# Altium project 16515-SBC_TO_MC2_PCA.PrjPcb (part 2 of 2)
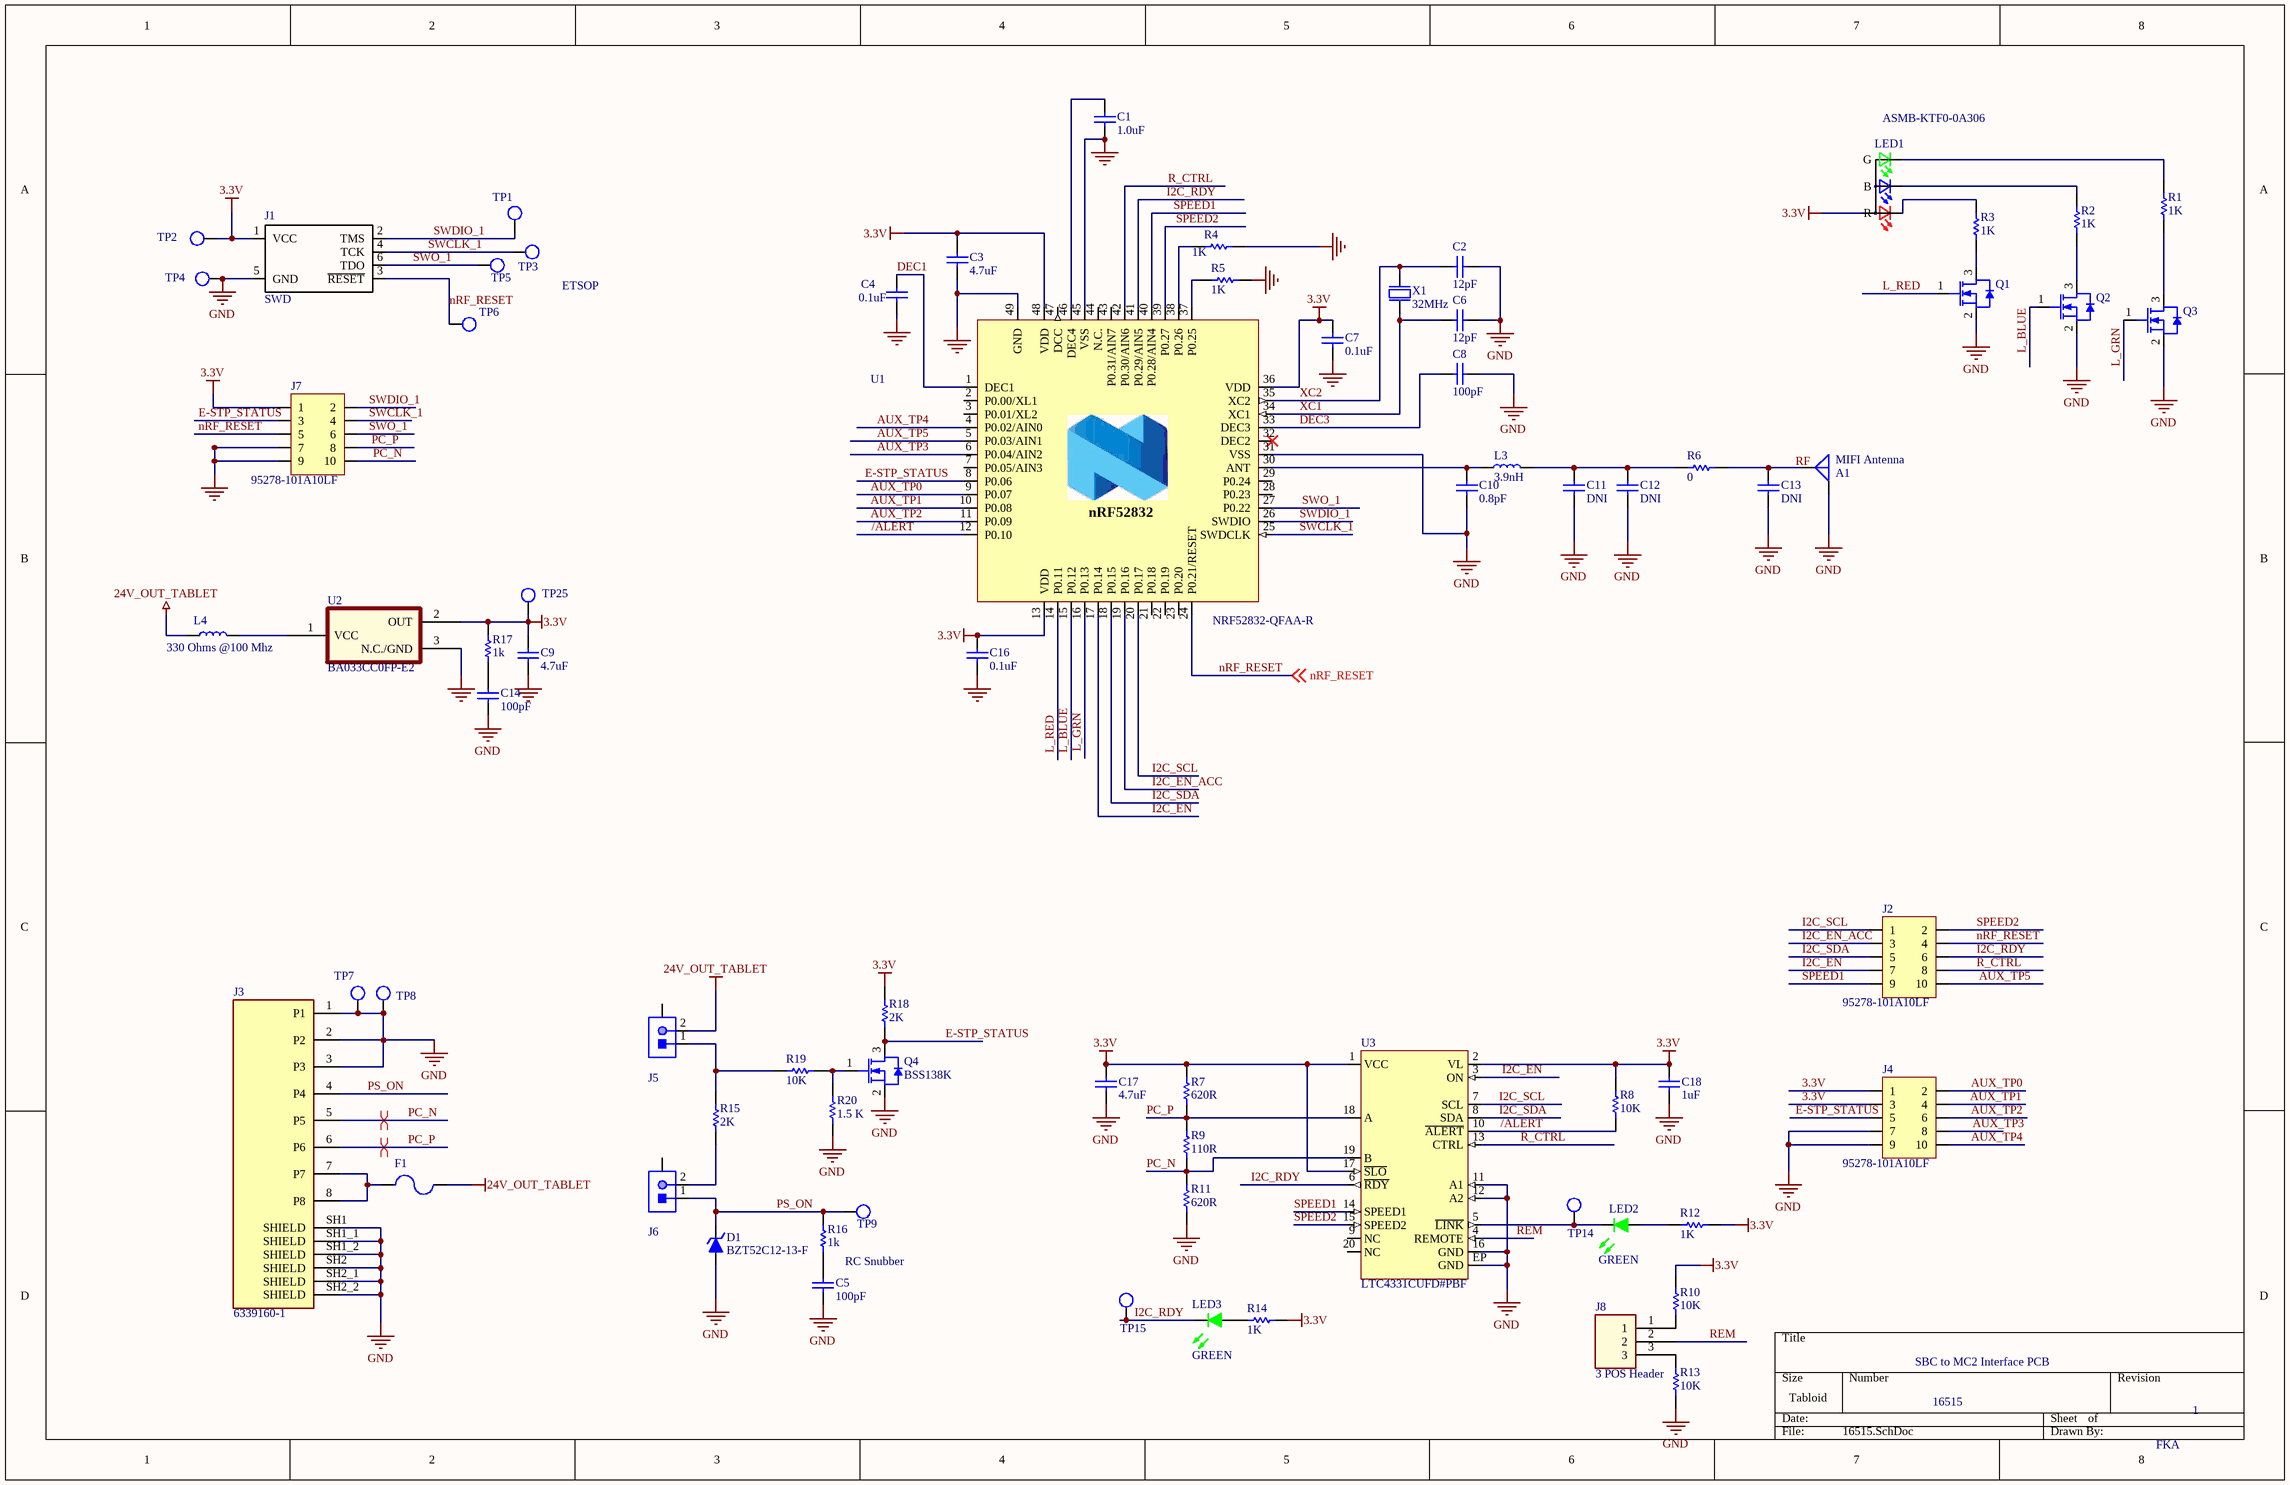
[diagram p1: 16515.SchDoc]

## Sheet 16515.SchDoc: SBC to MC2 Interface PCB (continued)

### Library data of the parts
A1 = ANT: Antenna
C1 = Cap NP: 1µF ±10% 6.3V Ceramic Capacitor X5R 0603 (1608 Metric); Manufacturer 1: Samsung; Manufacturer Part Number 1: CL10A105KQ8NNNC; Capacitance: 1uF; Value: 1.0uF; Supplier 1: Digi-Key; Supplier Part Number 1: 1276-1036-2-ND; Stock 1: 964000; Pricing 1: 4000=0.00607, 8000=0.00554, 12000=0.00528, 28000=0.00502, 100000=0.00363 (USD); RoHS: Yes; Mount: Surface Mount; Case/Package: 0603; Case Code (Metric): 1608; Case Code (Imperial): 0603; Min Operating Temperature: -55°C; Max Operating Temperature: 85°C; Packaging: Tape and Reel; Tolerance: 10%; Package Quantity: 1; Voltage Rating: 6.3V; Dielectric: X5R; Voltage Rating (DC): 6.3V; Length: 1.6mm; Height: 0.8mm; Width: 0.031inch; Thickness: 0.035inch; Depth: 0.8mm; Radiation Hardening: No; Lead Free: Lead Free; ComponentLink1URL: https://datasheet.ciiva.com/26838/getdatasheetpartid-355285-26838337.pdf?src-supplier=Verical; ComponentLink1Description: https://datasheet.ciiva.com/26838/getdatasheetpartid-355285-26838337.pdf?src-supplier=Verical; ComponentLink2URL: https://datasheet.ciiva.com/25801/cl10a105kq8nnnc-25801975.pdf?src-supplier=Digi-Key; ComponentLink2Description: https://datasheet.ciiva.com/25801/cl10a105kq8nnnc-25801975.pdf?src-supplier=Digi-Key; ComponentLink3URL: https://datasheet.ciiva.com/16199/cl10a105ko8nnnc-16199274.pdf?src-supplier=Future+Electronics; ComponentLink3Description: https://datasheet.ciiva.com/16199/cl10a105ko8nnnc-16199274.pdf?src-supplier=Future+Electronics
C2 C6 = Cap NP: 12pF ±5% 25V Ceramic Capacitor C0G, NP0 0402 (1005 Metric); Manufacturer 1: Murata; Manufacturer Part Number 1: GRM1555C1E120JA01D; Value: 12pF; Supplier 1: Digi-Key; Supplier Part Number 1: 490-8170-2-ND; Stock 1: 110000; Pricing 1: 10000=0.00588, 20000=0.00560, 30000=0.00532, 50000=0.00476, 100000=0.00420 (USD); RoHS: Yes; Mount: Surface Mount; Case/Package: 0402; Case Code (Metric): 1005; Case Code (Imperial): 0402; Min Operating Temperature: -55°C; Max Operating Temperature: 125°C; Capacitance: 12pF; Tolerance: 5%; Packaging: Tape and Reel; Package Quantity: 10000; Voltage Rating: 25V; Voltage Rating (DC): 25V; Dielectric: C0G; Termination: SMD/SMT; Length: 1mm; Height: 0.5mm; Width: 0.02inch; Thickness: 0.022inch; Depth: 0.5mm; Radiation Hardening: No; Lead Free: Lead Free; ComponentLink1URL: https://datasheet.ciiva.com/29542/grm1555c1e120ja01-01-29542163.pdf?src-supplier=Digi-Key; ComponentLink1Description: https://datasheet.ciiva.com/29542/grm1555c1e120ja01-01-29542163.pdf?src-supplier=Digi-Key; ComponentLink2URL: https://datasheet.ciiva.com/29542/partnumbering-e-01-29542165.pdf?src-supplier=Digi-Key; ComponentLink2Description: https://datasheet.ciiva.com/29542/partnumbering-e-01-29542165.pdf?src-supplier=Digi-Key; ComponentLink3URL: https://datasheet.ciiva.com/16467/product-16467323.pdf?src-supplier=Future+Electronics; ComponentLink3Description: https://datasheet.ciiva.com/16467/product-16467323.pdf?src-supplier=Future+Electronics
C3 C9 = Cap NP: 4.7µF ±10% 35V Ceramic Capacitor X5R 0603 (1608 Metric); Manufacturer 1: Murata; Manufacturer Part Number 1: GRM188R6YA475KE15D; Value: 4.7uF; Supplier 1: Digi-Key; Supplier Part Number 1: 490-7205-2-ND; Stock 1: 284000; Pricing 1: 4000=0.09384, 8000=0.08832, 12000=0.08556, 28000=0.08280, 100000=0.07728 (USD); RoHS: Yes; Mount: Surface Mount; Case/Package: 0603; Weight: 0.000222oz; Case Code (Metric): 1608; Case Code (Imperial): 0603; Material: Ceramic; Min Operating Temperature: -55°C; Max Operating Temperature: 85°C; Capacitance: 4.7uF; Tolerance: 10%; Voltage Rating: 35V; Packaging: Tape and Reel; Package Quantity: 4000; Dielectric: X5R; Voltage: 35V; Termination: SMD/SMT; Composition: Ceramic; Voltage Rating (DC): 35V; Length: 1.6mm; Height: 0.8mm; Width: 0.8mm; Thickness: 0.031inch; Depth: 0.8mm; REACH SVHC: No SVHC; Lead Free: Lead Free; ComponentLink1URL: https://datasheet.ciiva.com/46444/1769893-46444984.pdf?src-supplier=Element14; ComponentLink1Description: https://datasheet.ciiva.com/46444/1769893-46444984.pdf?src-supplier=Element14; ComponentLink2URL: https://datasheet.ciiva.com/46444/1769893-46444985.pdf?src-supplier=Element14; ComponentLink2Description: https://datasheet.ciiva.com/46444/1769893-46444985.pdf?src-supplier=Element14; ComponentLink3URL: https://datasheet.ciiva.com/14906/partnumbering-e-01-14906426.pdf?src-supplier=Digi-Key; ComponentLink3Description: https://datasheet.ciiva.com/14906/partnumbering-e-01-14906426.pdf?src-supplier=Digi-Key; ComponentLink4URL: https://datasheet.ciiva.com/14906/partnumbering-e-01-14906427.pdf?src-supplier=Digi-Key; ComponentLink4Description: https://datasheet.ciiva.com/14906/partnumbering-e-01-14906427.pdf?src-supplier=Digi-Key; ComponentLink5URL: https://datasheet.ciiva.com/14906/partnumbering-e-01-14906428.pdf?src-supplier=Digi-Key; ComponentLink5Description: https://datasheet.ciiva.com/14906/partnumbering-e-01-14906428.pdf?src-supplier=Digi-Key
C4 C7 C16 = Cap NP: 0.1µF ±10% 50V Ceramic Capacitor X5R 0402 (1005 Metric); Manufacturer 1: Yageo; Manufacturer Part Number 1: CC0402KRX5R9BB104; Capacitance: 100nF; Value: 0.1uF; Supplier 1: Digi-Key; Supplier Part Number 1: 311-3342-2-ND; Stock 1: 827411; Pricing 1: 10000=0.00666, 20000=0.00634, 30000=0.00602, 50000=0.00539, 100000=0.00476 (USD); RoHS: Yes; Mount: Surface Mount; Case/Package: 0402; Min Operating Temperature: -55°C; Max Operating Temperature: 85°C; Packaging: Tape and Reel; Voltage Rating: 50V; Tolerance: 10%; Voltage Rating (DC): 50V; Dielectric: X5R; Length: 0.039inch; Width: 0.02inch; Thickness: 0.022inch; Lead Free: Lead Free; Halogen Free: Halogen Free; ComponentLink1URL: http://www.yageo.com/documents/recent/UPY-GPHC_X5R_4V-to-50V_23.pdf?src-supplier=Digi-Key; ComponentLink1Description: http://www.yageo.com/documents/recent/UPY-GPHC_X5R_4V-to-50V_23.pdf?src-supplier=Digi-Key; ComponentLink2URL: http://www.yageo.com/documents/recent/UPY-GPHC_X5R_4V-to-50V_25.pdf?src-supplier=Digi-Key; ComponentLink2Description: http://www.yageo.com/documents/recent/UPY-GPHC_X5R_4V-to-50V_25.pdf?src-supplier=Digi-Key
C5 C11-C14 = Cap NP: Non-polarized Capactior
  C5 C14: Value: 100pF; Supplier 1: Digi-Key; Supplier Part Number 1: 490-11435-1-ND
  C11-C13: Value: DNI
C8 = Cap NP: 100pF ±1% 50V Ceramic Capacitor C0G, NP0 0402 (1005 Metric); Manufacturer 1: Kyocera AVX; Manufacturer Part Number 1: 04025A101FAT2A; Value: 100pF; Supplier 1: Digi-Key; Supplier Part Number 1: 478-3658-2-ND; Stock 1: 1289982; Pricing 1: 10000=0.03080, 20000=0.02926, 30000=0.02772, 50000=0.02541, 100000=0.02099 (USD); RoHS: Yes; Mount: Surface Mount,PCB; Case/Package: 0402; Number of Pins: 2; Case Code (Metric): 1005; Case Code (Imperial): 0402; Dielectric Material: Ceramic; Min Operating Temperature: -55°C; Max Operating Temperature: 125°C; Capacitance: 100pF; Tolerance: 1%; Packaging: Tape and Reel; Voltage Rating (DC): 50V; Dielectric: C0G; Voltage Rating: 50V; Package Quantity: 1; Termination: SMD/SMT; Voltage: 50V; Length: 1mm; Height: 0.56mm; Width: 0.02inch; Thickness: 0.022inch; Depth: 0.5mm; Radiation Hardening: No; REACH SVHC: No SVHC; Lead Free: Lead Free; ComponentLink1URL: https://datasheet.ciiva.com/1123/759117-1123472.pdf?src-supplier=Element14; ComponentLink1Description: https://datasheet.ciiva.com/1123/759117-1123472.pdf?src-supplier=Element14; ComponentLink2URL: https://datasheet.ciiva.com/153/ccog-153075.pdf?src-supplier=Digi-Key; ComponentLink2Description: https://datasheet.ciiva.com/153/ccog-153075.pdf?src-supplier=Digi-Key; ComponentLink3URL: https://datasheet.ciiva.com/153/ccog-153076.pdf?src-supplier=Digi-Key; ComponentLink3Description: https://datasheet.ciiva.com/153/ccog-153076.pdf?src-supplier=Digi-Key; ComponentLink4URL: https://datasheet.ciiva.com/153/ccog-153077.pdf?src-supplier=Digi-Key; ComponentLink4Description: https://datasheet.ciiva.com/153/ccog-153077.pdf?src-supplier=Digi-Key; ComponentLink5URL: https://datasheet.ciiva.com/28453/1796416-28453765.pdf?src-supplier=Element14; ComponentLink5Description: https://datasheet.ciiva.com/28453/1796416-28453765.pdf?src-supplier=Element14; ComponentLink6URL: https://datasheet.ciiva.com/5994/759117-5994870.pdf?src-supplier=Farnell; ComponentLink6Description: https://datasheet.ciiva.com/5994/759117-5994870.pdf?src-supplier=Farnell; ComponentLink7URL: https://datasheet.ciiva.com/22693/759117-22693575.pdf?src-supplier=Element14; ComponentLink7Description: https://datasheet.ciiva.com/22693/759117-22693575.pdf?src-supplier=Element14; ComponentLink8URL: https://datasheet.ciiva.com/28586/759117-28586552.pdf?src-supplier=Element14; ComponentLink8Description: https://datasheet.ciiva.com/28586/759117-28586552.pdf?src-supplier=Element14; ComponentLink9URL: https://datasheet.ciiva.com/14604/70001039-14604457.pdf?src-supplier=Allied+Electronics; ComponentLink9Description: https://datasheet.ciiva.com/14604/70001039-14604457.pdf?src-supplier=Allied+Electronics; ComponentLink10URL: https://datasheet.ciiva.com/22619/1796416-22619721.pdf?src-supplier=Element14; ComponentLink10Description: https://datasheet.ciiva.com/22619/1796416-22619721.pdf?src-supplier=Element14; ComponentLink11URL: https://datasheet.ciiva.com/7709/84496-7709757.pdf?src-supplier=Element14; ComponentLink11Description: https://datasheet.ciiva.com/7709/84496-7709757.pdf?src-supplier=Element14
C10 = Cap NP: 0.8pF ±0.25pF 50V Ceramic Capacitor C0G, NP0 0402 (1005 Metric); Manufacturer 1: Murata; Manufacturer Part Number 1: GRM1555C1HR80CA01D; Value: 0.8pF; Supplier 1: Digi-Key; Supplier Part Number 1: 490-12695-2-ND; Stock 1: 80000; Pricing 1: 10000=0.00819, 20000=0.00780, 30000=0.00741, 50000=0.00663, 100000=0.00585 (USD); RoHS: Yes; Mount: Surface Mount; Case/Package: 0402; Case Code (Metric): 1005; Case Code (Imperial): 0402; Min Operating Temperature: -55°C; Max Operating Temperature: 125°C; Package Quantity: 10000; Packaging: Tape and Reel; Capacitance: 0.8pF; Voltage Rating: 50V; Termination: SMD/SMT; Voltage Rating (DC): 50V; Length: 0.039inch; Width: 0.02inch; Thickness: 0.022inch; ComponentLink1URL: https://datasheet.ciiva.com/29538/partnumbering-e-01-29538363.pdf?src-supplier=Digi-Key; ComponentLink1Description: https://datasheet.ciiva.com/29538/partnumbering-e-01-29538363.pdf?src-supplier=Digi-Key; ComponentLink2URL: https://datasheet.ciiva.com/5418/c02e-5418252.pdf?src-supplier=Mouser; ComponentLink2Description: https://datasheet.ciiva.com/5418/c02e-5418252.pdf?src-supplier=Mouser
C17 = Cap NP: MURATA - GRM155R60J475ME87D - SMD Multilayer Ceramic Capacitor, 4.7 µF, 6.3 V, 0402 [1005 Metric], ± 20%, X5R, GRM Series; Voltage Rating: 6.3V; Value: 4.7uF; Supplier 1: Digi-Key; Supplier Part Number 1: 490-5408-1-ND; Manufacturer 1: Murata; Manufacturer Part Number 1: GRM155R60J475ME87D; RoHS: Yes; Category: Ceramic Capacitors; Stock 1: 1245512; Pricing 1: 1=0.14000, 10=0.10100, 50=0.05720, 100=0.04740, 500=0.03322, 1000=0.02750, 2500=0.02559, 5000=0.02341 (USD); Mount: Surface Mount; Case/Package: 0402; Case Code (Metric): 1005; Case Code (Imperial): 0402; Min Operating Temperature: -55°C; Max Operating Temperature: 85°C; Capacitance: 4.7uF; Tolerance: 20%; Dielectric: X5R; Package Quantity: 1; Packaging: Tape and Reel; Voltage: 6.3V; Voltage Rating (DC): 6.3V; Length: 1mm; Height: 0.5mm; Width: 0.02inch; Thickness: 0.022inch; Depth: 0.5mm; Radiation Hardening: No; REACH SVHC: No SVHC; Lead Free: Lead Free; ComponentLink1URL: https://datasheet.ciiva.com/3779/21116grm155r60j475me8723-3779229.pdf?src-supplier=Arrow+Electronics; ComponentLink1Description: https://datasheet.ciiva.com/3779/21116grm155r60j475me8723-3779229.pdf?src-supplier=Arrow+Electronics; ComponentLink2URL: https://datasheet.ciiva.com/136/partnumbering-e-01-136783.pdf?src-supplier=Digi-Key; ComponentLink2Description: https://datasheet.ciiva.com/136/partnumbering-e-01-136783.pdf?src-supplier=Digi-Key; ComponentLink3URL: https://datasheet.ciiva.com/136/partnumbering-e-01-136784.pdf?src-supplier=Digi-Key; ComponentLink3Description: https://datasheet.ciiva.com/136/partnumbering-e-01-136784.pdf?src-supplier=Digi-Key
C18 = Cap NP: CAP CER 1UF 10V X5R 0402; Manufacturer 1: Samsung; Manufacturer Part Number 1: CL05A105KP5NNNC; Material: Ceramic; Tolerance: 10%; Value: 1uF; Supplier 1: Digi-Key; Supplier Part Number 1: 1276-1076-1-ND; RoHS: Yes; Category: Ceramic Capacitors; Stock 1: 5830319; Pricing 1: 1=0.10000, 10=0.03900, 50=0.02140, 100=0.01750, 500=0.01252, 1000=0.00983, 2500=0.00894, 5000=0.00822 (USD); Mount: Surface Mount; Case/Package: 0402; Case Code (Metric): 1005; Case Code (Imperial): 0402; Contact Plating: Tin; Min Operating Temperature: -55°C; Max Operating Temperature: 85°C; Capacitance: 1uF; Dielectric: X5R; Package Quantity: 1; Packaging: Tape and Reel; Voltage Rating: 10V; Length: 1mm; Width: 0.02inch; Height: 0.5mm; Thickness: 0.022inch; Depth: 0.5mm; Radiation Hardening: No; ComponentLink1URL: https://datasheet.ciiva.com/15195/getdatasheetpartid-358390-15195630.pdf?src-supplier=Verical; ComponentLink1Description: https://datasheet.ciiva.com/15195/getdatasheetpartid-358390-15195630.pdf?src-supplier=Verical; ComponentLink2URL: https://datasheet.ciiva.com/29198/459159-da-01-en-vs-kondensator-0402-29198341.pdf?src-supplier=Conrad; ComponentLink2Description: https://datasheet.ciiva.com/29198/459159-da-01-en-vs-kondensator-0402-29198341.pdf?src-supplier=Conrad
D1 = BZT52C12-13-F: Zener Diode 12V 500mW ±5% Surface Mount SOD-123; Manufacturer 1: Diodes; Impedance: 25R; Peak Reverse Current: 100nA; Test Current: 5mA; Element Configuration: Single; Forward Voltage: 900mV; Output Current: 50mA; ESD Protection: No; Supplier 1: Digi-Key; Manufacturer Part Number 1: BZT52C12-13-F; Stock 1: 88458; Pricing 1: 10000=0.02576, 30000=0.02530, 50000=0.02273, 100000=0.02015, 250000=0.01970 (USD); RoHS: Yes; Mount: Surface Mount; Case/Package: SOD-123-2; Number of Pins: 2; Weight: 0.000353oz; Contact Plating: Tin,Matte; Min Operating Temperature: -65°C; Max Operating Temperature: 150°C; Max Power Dissipation: 500mW; Packaging: Tape and Reel; Package Quantity: 10000; Tolerance: 5%; Zener Voltage: 12V; Voltage Tolerance: 5%; Max Reverse Leakage Current: 100nA; Power Dissipation: 500mW; Zener Current: 100nA; Power Rating: 500mW; Length: 2.85mm; Height: 1.35mm; Width: 1.7mm; Radiation Hardening: No; Lead Free: Lead Free; ComponentLink1URL: https://datasheet.ciiva.com/26943/getdatasheetpartid-38893-26943274.pdf?src-supplier=Verical; ComponentLink1Description: https://datasheet.ciiva.com/26943/getdatasheetpartid-38893-26943274.pdf?src-supplier=Verical; Supplier Part Number 1: BZT52C1213-FDITR-ND; Voltage Rating (DC): 12V
F1 = Fuse: Polymeric PTC Resettable Fuse 33V 1.85A Ih Surface Mount 2920 (7351 Metric), Concave; Manufacturer 1: Bel; Manufacturer Part Number 1: 0ZCF0185FF2C; Max Current Rating: 40A; Trip Current: 3.7A; Time to Trip: 2.5s; Supplier 1: Digi-Key; Supplier Part Number 1: 507-1747-2-ND; Stock 1: 76000; Pricing 1: 2000=0.13090, 4000=0.12320, 6000=0.11550, 10000=0.10780 (USD); RoHS: Yes; Case Code (Metric): 7351; Case Code (Imperial): 2920; Package Quantity: 1; Packaging: Tape and Reel; Hold Current: 1.85A; Lead Free: Lead Free; ComponentLink1URL: https://datasheet.ciiva.com/18550/0zcf-18550652.pdf?src-supplier=Digi-Key; ComponentLink1Description: https://datasheet.ciiva.com/18550/0zcf-18550652.pdf?src-supplier=Digi-Key; ComponentLink2URL: https://datasheet.ciiva.com/18550/0zcf-18550653.pdf?src-supplier=Digi-Key; ComponentLink2Description: https://datasheet.ciiva.com/18550/0zcf-18550653.pdf?src-supplier=Digi-Key; ComponentLink3URL: https://datasheet.ciiva.com/18550/0zcf-18550654.pdf?src-supplier=Digi-Key; ComponentLink3Description: https://datasheet.ciiva.com/18550/0zcf-18550654.pdf?src-supplier=Digi-Key
J1 = TC2030-CTX: CBL PLUG-OF-NAILS TO CORTEX SWD; Manufacturer 1: Tag-Connect; Supplier 1: Digi-Key; Manufacturer Part Number 1: TC2030-CTX; Stock 1: 87; RoHS: Yes; ComponentLink1URL: http://www.tag-connect.com/Materials/TC2030-CTX.pdf?src-supplier=Digi-Key; ComponentLink1Description: http://www.tag-connect.com/Materials/TC2030-CTX.pdf?src-supplier=Digi-Key
J2 J4 J7 = 95278-101A10LF: Conn Unshrouded Header HDR 10 POS 2.54mm Solder ST Top Entry SMD T/R; Manufacturer 1: Amphenol FCI; Manufacturer Part Number 1: 20021121-00010C4LF; Number of Contacts: 10; Contact Resistance: 30mR; Current Rating: 1A; Voltage Rating: 125V; Insulation Resistance: 100MR; Gender: Male; Connector Type: Male Pin,Header; Pitch: 1.27mm; Row Spacing: 0.05inch; Stack Height: 3mm; System: Connector; Supplier 1: Digi-Key; Stock 1: 75000; Pricing 1: 600=0.48798, 1200=0.43376, 1800=0.40665, 3000=0.39310, 6000=0.37954, 15000=0.35243 (USD); RoHS: Yes; Mount: Surface Mount; Contact Plating: Gold; Contact Material: Copper Alloy,Copper,Gold; Color: Black; Housing Color: Black; Housing Material: Thermoplastic; Min Operating Temperature: -40°C; Max Operating Temperature: 85°C; Number of Rows: 2; Termination: Solder; Packaging: Tape and Reel; Package Quantity: 600; Number of Positions: 10; Max Voltage Rating (AC): 125V; Orientation: Straight; Length: 6.35mm; Contact Mating Length: 0.12inch; Depth: 3.4mm; Radiation Hardening: No; REACH SVHC: No SVHC; ComponentLink1URL: https://datasheet.ciiva.com/26853/getdatasheetpartid-177140-26853984.pdf?src-supplier=Verical; ComponentLink1Description: https://datasheet.ciiva.com/26853/getdatasheetpartid-177140-26853984.pdf?src-supplier=Verical; ComponentLink2URL: https://datasheet.ciiva.com/11749/0900766b8118d62a-11749057.pdf?src-supplier=RSComponents; ComponentLink2Description: https://datasheet.ciiva.com/11749/0900766b8118d62a-11749057.pdf?src-supplier=RSComponents; ComponentLink3URL: https://datasheet.ciiva.com/1433/20021121-1433280.pdf?src-supplier=Element14; ComponentLink3Description: https://datasheet.ciiva.com/1433/20021121-1433280.pdf?src-supplier=Element14; ComponentLink4URL: https://datasheet.ciiva.com/9474/20021121-9474140.pdf?src-supplier=Avnet; ComponentLink4Description: https://datasheet.ciiva.com/9474/20021121-9474140.pdf?src-supplier=Avnet; ComponentLink5URL: https://datasheet.ciiva.com/409/20021121-409149.pdf?src-supplier=Digi-Key; ComponentLink5Description: https://datasheet.ciiva.com/409/20021121-409149.pdf?src-supplier=Digi-Key; ComponentLink6URL: https://datasheet.ciiva.com/409/20021121-409150.pdf?src-supplier=Digi-Key; ComponentLink6Description: https://datasheet.ciiva.com/409/20021121-409150.pdf?src-supplier=Digi-Key; ComponentLink7URL: https://datasheet.ciiva.com/16691/20021121-16691022.pdf?src-supplier=Avnet+Europe; ComponentLink7Description: https://datasheet.ciiva.com/16691/20021121-16691022.pdf?src-supplier=Avnet+Europe; ComponentLink8URL: https://datasheet.ciiva.com/409/20021121-409151.pdf?src-supplier=Digi-Key; ComponentLink8Description: https://datasheet.ciiva.com/409/20021121-409151.pdf?src-supplier=Digi-Key; ComponentLink9URL: https://datasheet.ciiva.com/5130/20021121-5130207.pdf?src-supplier=Mouser; ComponentLink9Description: https://datasheet.ciiva.com/5130/20021121-5130207.pdf?src-supplier=Mouser
J3 = 6339160-1: PCB Mounted Jacks - Single Port, Multi-port and Stacked MJ, RJ45, SMT, SHLD, PANEL GRD; Manufacturer 1: TE; Centerline_Pitch: 1.02 mm[.04 in]; MF: TE Connectivity; Number_of_Positions: 8; MP: 6339160-1; EU_RoHS_Compliance: Compliant; Availability: Unavailable; SnapEDA_Link: https://www.snapeda.com/parts/6339160-1/TE%20Connectivity%20AMP%20Connectors/view-part/517213/?ref=snap; TE_purchase_URL: https://www.te.com/usa-en/product-6339160-1.html?te_bu=Cor&te_type=disp&te_campaign=seda_glo_cor-seda-global-disp-prtnr-fy19-seda-model-bom-cta_sma-317_1&elqCampaignId=32493; Package: None; Price: None; Parameter 1: *; Manufacturer Part Number 1: 6339160-1
J5 J6 = SM02B-PASS-TBT(LF)(SN): CONN HEADER SMD R/A 2POS 2MM; Manufacturer 1: JST; Number of Positions: 2; Connector Type: Male Pin; Pitch: 0.079inch; System: Connector; Supplier 1: Digi-Key; Manufacturer Part Number 1: SM02B-PASS-TBT(LF)(SN); Stock 1: 191000; Pricing 1: 1000=0.30811, 2000=0.29877, 3000=0.28010, 5000=0.27076, 10000=0.25209, 25000=0.24275 (USD); RoHS: Yes; Mount: Surface Mount; Color: Natural; Contact Plating: Tin; Number of Rows: 1; Fastening Type: Ramp; Packaging: Cut Tape; Termination: Solder; Lead Free: Lead Free; ComponentLink1URL: https://datasheet.ciiva.com/740/epa-f-740784.pdf?src-supplier=Digi-Key; ComponentLink1Description: https://datasheet.ciiva.com/740/epa-f-740784.pdf?src-supplier=Digi-Key; ComponentLink2URL: https://datasheet.ciiva.com/16487/epa-f-16487127.pdf?src-supplier=Future+Electronics; ComponentLink2Description: https://datasheet.ciiva.com/16487/epa-f-16487127.pdf?src-supplier=Future+Electronics; ComponentLink3URL: https://datasheet.ciiva.com/726/epa-f-726798.pdf?src-supplier=Digi-Key; ComponentLink3Description: https://datasheet.ciiva.com/726/epa-f-726798.pdf?src-supplier=Digi-Key; ComponentLink4URL: https://datasheet.ciiva.com/740/epa-f-740798.pdf?src-supplier=Digi-Key; ComponentLink4Description: https://datasheet.ciiva.com/740/epa-f-740798.pdf?src-supplier=Digi-Key; Supplier Part Number 1: 455-2650-2-ND
J8 = Component_1: CONN HEADER VERT 3POS 2.54MM; Manufacturer 1: Würth Elektronik; Manufacturer Part Number 1: 61300311121
L3 = Inductor: 3.9nH Unshielded Thin Film Inductor 170mA 500mOhm Max 0402 (1005 Metric); Manufacturer 1: Murata; Manufacturer Part Number 1: LQP15MN3N9B02D; Core Material: Non-Magnetic; DC Resistance (DCR): 500mR; Q Factor: 13; Self Resonant Frequency: 6GHz; Test Frequency: 500MHz; Value: 3.9nH; Supplier 1: Digi-Key; Supplier Part Number 1: 490-1131-2-ND; Stock 1: 40000; Pricing 1: 10000=0.05344, 30000=0.05177, 50000=0.05010, 100000=0.04843 (USD); RoHS: Yes; Mount: Surface Mount; Case/Package: 0402; Case Code (Metric): 1005; Case Code (Imperial): 0402; Min Operating Temperature: -40°C; Max Operating Temperature: 85°C; Inductance: 3.9nH; Max DC Current: 170mA; Packaging: Tape and Reel; Package Quantity: 10000; Current Rating: 170mA; Shielding: Unshielded; Termination: SMD/SMT; Composition: Thin Film; DC Current: 170mA; Military Standard: Not; Length: 1.1mm; Height: 0.35mm; Depth: 0.6mm; Width: 0.5mm; Height - Seated (Max): 0.018inch; Radiation Hardening: No; Lead Free: Lead Free; ComponentLink1URL: https://datasheet.ciiva.com/27054/1865137-27054329.pdf?src-supplier=Jameco; ComponentLink1Description: https://datasheet.ciiva.com/27054/1865137-27054329.pdf?src-supplier=Jameco; ComponentLink2URL: https://datasheet.ciiva.com/11799/0900766b80f155d9-11799807.pdf?src-supplier=RSComponents; ComponentLink2Description: https://datasheet.ciiva.com/11799/0900766b80f155d9-11799807.pdf?src-supplier=RSComponents; ComponentLink3URL: https://datasheet.ciiva.com/16362/l0075s0084lqp15m-16362181.pdf?src-supplier=Future+Electronics; ComponentLink3Description: https://datasheet.ciiva.com/16362/l0075s0084lqp15m-16362181.pdf?src-supplier=Future+Electronics; ComponentLink4URL: https://datasheet.ciiva.com/18230/getdatasheetpartid-153200-18230711.pdf?src-supplier=Verical; ComponentLink4Description: https://datasheet.ciiva.com/18230/getdatasheetpartid-153200-18230711.pdf?src-supplier=Verical; ComponentLink5URL: https://datasheet.ciiva.com/8510/l0075s0084lqp15m-8510329.pdf?src-supplier=Avnet; ComponentLink5Description: https://datasheet.ciiva.com/8510/l0075s0084lqp15m-8510329.pdf?src-supplier=Avnet; ComponentLink6URL: https://datasheet.ciiva.com/4976/product-4976732.pdf?src-supplier=Mouser; ComponentLink6Description: https://datasheet.ciiva.com/4976/product-4976732.pdf?src-supplier=Mouser; ComponentLink7URL: https://datasheet.ciiva.com/1039/l0075s0084lqp15m-1039837.pdf?src-supplier=Digi-Key; ComponentLink7Description: https://datasheet.ciiva.com/1039/l0075s0084lqp15m-1039837.pdf?src-supplier=Digi-Key; ComponentLink8URL: https://datasheet.ciiva.com/1039/l0075s0084lqp15m-1039838.pdf?src-supplier=Digi-Key; ComponentLink8Description: https://datasheet.ciiva.com/1039/l0075s0084lqp15m-1039838.pdf?src-supplier=Digi-Key; ComponentLink9URL: https://datasheet.ciiva.com/1039/l0075s0084lqp15m-1039839.pdf?src-supplier=Digi-Key; ComponentLink9Description: https://datasheet.ciiva.com/1039/l0075s0084lqp15m-1039839.pdf?src-supplier=Digi-Key; ComponentLink10URL: https://datasheet.ciiva.com/8510/l0075s0084lqp15m-8510975.pdf?src-supplier=Avnet; ComponentLink10Description: https://datasheet.ciiva.com/8510/l0075s0084lqp15m-8510975.pdf?src-supplier=Avnet
L4 = Inductor: 10µH Unshielded Wirewound Inductor 80mA 360mOhm 0603 (1608 Metric); Manufacturer 1: Taiyo; Manufacturer Part Number 1: LBMF1608T100K; Inductance: 10H; Self Resonant Frequency: 32MHz; Value: 330 Ohms @100 Mhz; Supplier 1: Digi-Key; Supplier Part Number 1: 587-1714-2-ND; Stock 1: 0; Pricing 1: 3000=0.08100, 6000=0.07650, 15000=0.07200, 30000=0.06975, 75000=0.06750, 150000=0.06525 (USD); RoHS: No; Case/Package: 0603; Packaging: Cut Tape; Shielding: Unshielded; Length: 1.6mm; Height: 800um; Width: 800um; Halogen Free: Halogen Free; Lead Free: Lead Free
LED1 = ASMB-KTF0-0A306: LED Multi-Color Chip Red/Green/Blue 620nm/524nm/471nm 20mA 4-Pin PLCC T/R; Manufacturer 1: Broadcom; ComponentLink1URL: http://www.farnell.com/datasheets/2608172.pdf?src-supplier=Farnell; ComponentLink1Description: http://www.farnell.com/datasheets/2608172.pdf?src-supplier=Farnell; ComponentLink2URL: https://media.digikey.com/pdf/Data%20Sheets/Avago%20PDFs/ASMB-KTF0-0A306.pdf?src-supplier=Digi-Key; ComponentLink2Description: https://media.digikey.com/pdf/Data%20Sheets/Avago%20PDFs/ASMB-KTF0-0A306.pdf?src-supplier=Digi-Key; ComponentLink3URL: http://datasheet.octopart.com/ASMB-KTF0-0A306-Broadcom-datasheet-101667862.pdf?src-supplier=Avago; ComponentLink3Description: http://datasheet.octopart.com/ASMB-KTF0-0A306-Broadcom-datasheet-101667862.pdf?src-supplier=Avago; Supplier 1: Digi-Key; Manufacturer Part Number 1: ASMB-KTF0-0A306; Stock 1: 4838; Pricing 1: 1=0.43000, 10=0.31200, 100=0.20350, 500=0.14628, 1000=0.11448, 2500=0.10494 (USD); RoHS: No; Supplier Part Number 1: 516-3906-6-ND
LED2 LED3 = LTST-C191KGKT: Green 571nm LED Indication - Discrete 2V 0603 (1608 Metric); Manufacturer 1: Vishay Lite-On; Lens Color: Colorless; Lens Transparency: Clear; Viewing Angle: 130°; Luminous Intensity: 35mcd; Test Current: 20mA; Wavelength: 574nm; Lens Style: Diffused,Colorless,Rectangular,Clear; Forward Current: 30mA; Number of Elements: 1; Power Dissipation: 75mW; Reverse Voltage: 5V; Supplier 1: Digi-Key; Supplier Part Number 1: 160-1446-2-ND; RoHS: Yes; Pricing 1: 5000=0.04040, 10000=0.03636, 25000=0.03232, 50000=0.02929, 125000=0.02727 (USD); Packaging: Tape and Reel; Color: Green; ComponentLink1URL: https://datasheet.ciiva.com/12400/100-ltst-c191kgkt-53586-12400818.pdf?src-supplier=Mouser; ComponentLink1Description: https://datasheet.ciiva.com/12400/100-ltst-c191kgkt-53586-12400818.pdf?src-supplier=Mouser; Manufacturer Part Number 1: LTST-C191KGKT; Stock 1: 975000; Mount: Surface Mount; Case/Package: 0603; Number of Pins: 2; Case Code (Metric): 1608; Case Code (Imperial): 0603; Min Operating Temperature: -55°C; Max Operating Temperature: 85°C; Package Quantity: 1; Forward Voltage: 2V; Dominant Wavelength: 571nm; Illumination Color: Green; Number of LEDs: 1; Power Rating: 75mW; Length: 1.6mm; Height: 0.55mm; Width: 0.8mm; Depth: 0.8mm; Radiation Hardening: No; Lead Free: Lead Free; ComponentLink2URL: https://datasheet.ciiva.com/11773/0900766b80dc02b1-11773629.pdf?src-supplier=RSComponents; ComponentLink2Description: https://datasheet.ciiva.com/11773/0900766b80dc02b1-11773629.pdf?src-supplier=RSComponents; ComponentLink3URL: https://datasheet.ciiva.com/16215/ltst-c191kgkt-16215151.pdf?src-supplier=Future+Electronics; ComponentLink3Description: https://datasheet.ciiva.com/16215/ltst-c191kgkt-16215151.pdf?src-supplier=Future+Electronics; ComponentLink4URL: https://datasheet.ciiva.com/2109/s-110-ltst-c191kgkt-2109973.pdf?src-supplier=Digi-Key; ComponentLink4Description: https://datasheet.ciiva.com/2109/s-110-ltst-c191kgkt-2109973.pdf?src-supplier=Digi-Key; ComponentLink5URL: https://datasheet.ciiva.com/2109/s-110-ltst-c191kgkt-2109974.pdf?src-supplier=Digi-Key; ComponentLink5Description: https://datasheet.ciiva.com/2109/s-110-ltst-c191kgkt-2109974.pdf?src-supplier=Digi-Key; ComponentLink6URL: https://datasheet.ciiva.com/2109/s-110-ltst-c191kgkt-2109975.pdf?src-supplier=Digi-Key; ComponentLink6Description: https://datasheet.ciiva.com/2109/s-110-ltst-c191kgkt-2109975.pdf?src-supplier=Digi-Key; ComponentLink7URL: https://datasheet.ciiva.com/15223/getdatasheetpartid-103913-15223276.pdf?src-supplier=Verical; ComponentLink7Description: https://datasheet.ciiva.com/15223/getdatasheetpartid-103913-15223276.pdf?src-supplier=Verical
Q1-Q3 = 2SK3018T106: Trans MOSFET N-CH 30V 0.1A 3-Pin UMT T/R; Manufacturer 1: Rohm; Continuous Drain Current (ID): 100mA; Gate to Source Voltage (Vgs): 20V; Turn-Off Delay Time: 80ns; Turn-On Delay Time: 15ns; Rise Time: 35ns; Element Configuration: Single; Power Dissipation: 200mW; Drain to Source Resistance: 7R; Threshold Voltage: 1.5V; Rds On Max: 8R; Input Capacitance: 13pF; On-State Resistance: 13R; Supplier 1: Digi-Key; Manufacturer Part Number 1: 2SK3018T106; RoHS: Yes; Category: MOSFETs; Stock 1: 40757; Pricing 1: 1=0.37000, 10=0.30100, 25=0.25200, 100=0.12320, 500=0.10276, 1000=0.07140 (USD); Mount: Surface Mount; Case/Package: SOT-323; Number of Pins: 3; Contact Plating: Copper,Tin,Silver; Min Operating Temperature: -55°C; Max Operating Temperature: 150°C; Drain to Source Breakdown Voltage: 30V; Fall Time: 35ns; Drain to Source Voltage (Vdss): 30V; Max Power Dissipation: 200mW; Package Quantity: 3000; Termination: SMD/SMT; Packaging: Tape and Reel; Nominal Vgs: 1.5V; Voltage Rating (DC): 30V; Current Rating: 100mA; Dual Supply Voltage: 30V; Length: 2mm; Height: 0.8mm; Width: 1.25mm; Radiation Hardening: No; REACH SVHC: No SVHC; Lead Free: Lead Free; ComponentLink1URL: https://datasheet.ciiva.com/13043/2sk3018-209190-13043441.pdf?src-supplier=Mouser; ComponentLink1Description: https://datasheet.ciiva.com/13043/2sk3018-209190-13043441.pdf?src-supplier=Mouser; ComponentLink2URL: https://datasheet.ciiva.com/16307/2sk3018-16307708.pdf?src-supplier=Future+Electronics; ComponentLink2Description: https://datasheet.ciiva.com/16307/2sk3018-16307708.pdf?src-supplier=Future+Electronics; ComponentLink3URL: https://datasheet.ciiva.com/934/2sk3018-934635.pdf?src-supplier=Digi-Key; ComponentLink3Description: https://datasheet.ciiva.com/934/2sk3018-934635.pdf?src-supplier=Digi-Key; ComponentLink4URL: https://datasheet.ciiva.com/1188/2sk3018-1188589.pdf?src-supplier=Element14; ComponentLink4Description: https://datasheet.ciiva.com/1188/2sk3018-1188589.pdf?src-supplier=Element14; ComponentLink5URL: https://datasheet.ciiva.com/934/2sk3018-934636.pdf?src-supplier=Digi-Key; ComponentLink5Description: https://datasheet.ciiva.com/934/2sk3018-934636.pdf?src-supplier=Digi-Key; Supplier Part Number 1: 2SK3018T106CT-ND
Q4 = BSS138K: N-Channel 50V 220mA (Ta) 350mW (Ta) Surface Mount SOT-23-3; Manufacturer 1: ON Semiconductor / Fairchild; Input Capacitance: 58pF; Rds On Max: 1.6R; Element Configuration: Single; Gate to Source Voltage (Vgs): 12V; Number of Elements: 1; Nominal Vgs: 600mV; Rise Time: 5ns; Fall Time: 35ns; Drain to Source Resistance: 2.5R; Turn-Off Delay Time: 60ns; Supplier 1: Digi-Key; Manufacturer Part Number 1: BSS138K; Stock 1: 162000; Pricing 1: 3000=0.06968, 6000=0.06027, 9000=0.04998, 30000=0.04910, 75000=0.04410 (USD); RoHS: Yes; Mount: Surface Mount; Case/Package: SOT-23; Number of Pins: 3; Weight: 0.03g; Contact Plating: Tin,Matte; Min Operating Temperature: -55°C; Max Operating Temperature: 150°C; Packaging: Tape and Reel; Max Power Dissipation: 350mW; Continuous Drain Current (ID): 220mA; Drain to Source Voltage (Vdss): 50V; Package Quantity: 1; On-State Resistance: 1.6R; Drain to Source Breakdown Voltage: 50V; Power Dissipation: 350mW; Turn-On Delay Time: 5ns; Threshold Voltage: 600mV; Length: 2.92mm; Height: 0.93mm; Width: 1.3mm; Lead Free: Lead Free; REACH SVHC: No SVHC; ComponentLink1URL: https://datasheet.ciiva.com/16965/bss138k-16965154.pdf?src-supplier=Future+Electronics; ComponentLink1Description: https://datasheet.ciiva.com/16965/bss138k-16965154.pdf?src-supplier=Future+Electronics; ComponentLink2URL: https://datasheet.ciiva.com/931/bss138k-931784.pdf?src-supplier=Digi-Key; ComponentLink2Description: https://datasheet.ciiva.com/931/bss138k-931784.pdf?src-supplier=Digi-Key; ComponentLink3URL: https://datasheet.ciiva.com/931/bss138k-931785.pdf?src-supplier=Digi-Key; ComponentLink3Description: https://datasheet.ciiva.com/931/bss138k-931785.pdf?src-supplier=Digi-Key; ComponentLink4URL: https://datasheet.ciiva.com/8115/bss138k-8115354.pdf?src-supplier=Avnet; ComponentLink4Description: https://datasheet.ciiva.com/8115/bss138k-8115354.pdf?src-supplier=Avnet; ComponentLink5URL: https://datasheet.ciiva.com/931/bss138k-931783.pdf?src-supplier=Digi-Key; ComponentLink5Description: https://datasheet.ciiva.com/931/bss138k-931783.pdf?src-supplier=Digi-Key; Supplier Part Number 1: BSS138KTR-ND
R1-R5 R12 R14 = Res: Resistor1 kOhms ±1% 0.063W, 1/16W Chip Resistor 0402 (1005 Metric) Moisture Resistant Thick Film; Manufacturer 1: Samsung; Manufacturer Part Number 1: RC1005F102CS; Resistance: 1kR; Max Power Dissipation: 63mW; Temperature Coefficient: 100ppm/°C; Voltage Rating (DC): 50V; VALUE: 1K; Supplier 1: Digi-Key; Supplier Part Number 1: 1276-3430-2-ND; Stock 1: 7720000; Pricing 1: 10000=0.00634, 30000=0.00557, 50000=0.00511, 100000=0.00501 (USD); RoHS: Yes; Case/Package: 0402; Case Code (Metric): 1005; Case Code (Imperial): 0402; Contact Plating: Tin; Min Operating Temperature: -55°C; Max Operating Temperature: 155°C; Tolerance: 1%; Packaging: Tape and Reel; Composition: Thick Film; Number of Terminations: 2; Military Standard: Not; Features: Moisture Resistant; Length: 1mm; Height: 0.016inch; Width: 0.02inch; Depth: 0.5mm; Radiation Hardening: No; Lead Free: Lead Free; ComponentLink1URL: https://datasheet.ciiva.com/15196/getdatasheetpartid-499906-15196213.pdf?src-supplier=Verical; ComponentLink1Description: https://datasheet.ciiva.com/15196/getdatasheetpartid-499906-15196213.pdf?src-supplier=Verical; ComponentLink2URL: https://datasheet.ciiva.com/26185/chip-resistor-150112-1-26185573.pdf?src-supplier=Digi-Key; ComponentLink2Description: https://datasheet.ciiva.com/26185/chip-resistor-150112-1-26185573.pdf?src-supplier=Digi-Key; ComponentLink3URL: https://datasheet.ciiva.com/26185/chip-resistor-150112-1-26185542.pdf?src-supplier=Digi-Key; ComponentLink3Description: https://datasheet.ciiva.com/26185/chip-resistor-150112-1-26185542.pdf?src-supplier=Digi-Key
R6 = Res: RES 0 OHM JUMPER 1/16W 0402; Manufacturer 1: Stackpole Electronics Inc; Manufacturer Part Number 1: RMCF0402ZT0R00; VALUE: 0
R7 = Res: YAGEO - RC0402FR-07620RL - Surface Mount Chip Resistor, Thick Film, RC Series, 620 ohm, 63 mW, 1%, 50 V, 0402 [1005 Metric] RoHS Compliant: Yes; Resistance: 620; Temperature Coefficient: 100ppm/°C; Power Rating: 63mW; Voltage Rating: 50V; VALUE: 620R; Supplier 1: Digi-Key; Supplier Part Number 1: 311-620LRTR-ND; Manufacturer 1: Yageo; Manufacturer Part Number 1: RC0402FR-07620RL; RoHS: Yes; Category: Chip SMD Resistors; Stock 1: 180000; Pricing 1: 10000=0.00178, 30000=0.00156, 50000=0.00143, 100000=0.00140 (USD); Case/Package: 0402; Contact Plating: Tin,Matte; Case Code (Imperial): 0402; Case Code (Metric): 1005; Size Code: 0402; Min Operating Temperature: -55°C; Max Operating Temperature: 155°C; Tolerance: 1%; Resistor Type: Thick Film; Packaging: Tape and Reel; Package Quantity: 1; Termination: SMD/SMT; Number of Terminations: 2; Max Power Dissipation: 63mW; Voltage Rating (DC): 50V; Features: Moisture Resistant; Series: RC; Construction: Rectangular; Resistance Tolerance: 1%; Length: 1mm; Width: 0.5mm; Height: 0.016inch; Depth: 0.5mm; REACH SVHC: Unknown; Military Standard: Not; Lead Free: Lead Free; RoHS Compliant: Yes; ComponentLink1URL: https://datasheet.ciiva.com/16867/pyu-rc0402-51-rohs-l-6-16867429.pdf?src-supplier=Avnet+Europe; ComponentLink1Description: https://datasheet.ciiva.com/16867/pyu-rc0402-51-rohs-l-6-16867429.pdf?src-supplier=Avnet+Europe; ComponentLink2URL: https://datasheet.ciiva.com/2453/pyu-r-int-thick-7-2453670.pdf?src-supplier=Digi-Key; ComponentLink2Description: https://datasheet.ciiva.com/2453/pyu-r-int-thick-7-2453670.pdf?src-supplier=Digi-Key; ComponentLink3URL: https://datasheet.ciiva.com/17066/pyu-rc0402-51-rohs-l-6-r-17066550.pdf?src-supplier=Future+Electronics; ComponentLink3Description: https://datasheet.ciiva.com/17066/pyu-rc0402-51-rohs-l-6-r-17066550.pdf?src-supplier=Future+Electronics; ComponentLink4URL: https://datasheet.ciiva.com/2453/pyu-r-int-thick-7-2453672.pdf?src-supplier=Digi-Key; ComponentLink4Description: https://datasheet.ciiva.com/2453/pyu-r-int-thick-7-2453672.pdf?src-supplier=Digi-Key; ComponentLink5URL: https://datasheet.ciiva.com/7850/1018594-7850062.pdf?src-supplier=Element14; ComponentLink5Description: https://datasheet.ciiva.com/7850/1018594-7850062.pdf?src-supplier=Element14; ComponentLink6URL: https://datasheet.ciiva.com/7850/1018594-7850063.pdf?src-supplier=Element14; ComponentLink6Description: https://datasheet.ciiva.com/7850/1018594-7850063.pdf?src-supplier=Element14; ComponentLink7URL: https://datasheet.ciiva.com/8885/pyu-rc0402-51-rohs-l-6-8885125.pdf?src-supplier=Avnet; ComponentLink7Description: https://datasheet.ciiva.com/8885/pyu-rc0402-51-rohs-l-6-8885125.pdf?src-supplier=Avnet; ComponentLink8URL: https://datasheet.ciiva.com/28388/pyu-rc0402-51-rohs-l-6-28388966.pdf?src-supplier=Avnet+Europe; ComponentLink8Description: https://datasheet.ciiva.com/28388/pyu-rc0402-51-rohs-l-6-28388966.pdf?src-supplier=Avnet+Europe; ComponentLink9URL: https://datasheet.ciiva.com/2453/pyu-r-int-thick-7-2453671.pdf?src-supplier=Digi-Key; ComponentLink9Description: https://datasheet.ciiva.com/2453/pyu-r-int-thick-7-2453671.pdf?src-supplier=Digi-Key
R8 R10 R13 = Res: RES SMD 10K OHM 1% 1/4W 0603; Manufacturer 1: Panasonic Electronic Components; Manufacturer Part Number 1: ERJ-PA3F1002V; VALUE: 10K
R9 = Res: Res Thick Film 0402 110 Ohm 1% 0.063W(1/16W) ±100ppm/C Pad SMD Automotive T/R; Manufacturer 1: Stackpole Electronics; Manufacturer Part Number 1: RMCF0402FT110R; Max Power Dissipation: 63mW; Temperature Coefficient: 100ppm/°C; VALUE: 110R; Supplier 1: Digi-Key; Supplier Part Number 1: RMCF0402FT110RTR-ND; RoHS: Yes; Category: Chip SMD Resistors; Stock 1: 90000; Pricing 1: 10000=0.00163, 30000=0.00144, 50000=0.00132, 100000=0.00129 (USD); Mount: Surface Mount; Case/Package: 0402; Case Code (Metric): 1005; Case Code (Imperial): 0402; Contact Plating: Tin,Matte; Min Operating Temperature: -55°C; Max Operating Temperature: 155°C; Packaging: Tape and Reel; Resistance: 110R; Tolerance: 1%; Package Quantity: 1; Resistor Type: Thick Film; Number of Terminations: 2; Features: Automotive AEC-Q200; Series: RMCF; Length: 0.039inch; Width: 0.02inch; Height: 0.016inch; Lead Free: Lead Free; RoHS Compliant: Yes; ComponentLink1URL: https://www.seielect.com/Catalog/SEI-RMCF_RMCP.pdf?src-supplier=Avnet; ComponentLink1Description: https://www.seielect.com/Catalog/SEI-RMCF_RMCP.pdf?src-supplier=Avnet; ComponentLink2URL: https://www.seielect.com/Catalog/SEI-RMCF_RMCP.pdf?src-supplier=Digi-Key; ComponentLink2Description: https://www.seielect.com/Catalog/SEI-RMCF_RMCP.pdf?src-supplier=Digi-Key; ComponentLink3URL: https://www.seielect.com/catalog/SEI-Packaging.pdf?src-supplier=Digi-Key; ComponentLink3Description: https://www.seielect.com/catalog/SEI-Packaging.pdf?src-supplier=Digi-Key
R11 = Res: YAGEO - RC0402FR-07620RL - Surface Mount Chip Resistor, Thick Film, RC Series, 620 ohm, 63 mW, 1%, 50 V, 0402 [1005 Metric] RoHS Compliant: Yes; Temperature Coefficient: 100ppm/°C; Power Rating: 63mW; Voltage Rating: 50V; VALUE: 620R; Supplier 1: Digi-Key; Supplier Part Number 1: 311-620LRTR-ND; Manufacturer 1: Yageo; Manufacturer Part Number 1: RC0402FR-07620RL; RoHS: Yes; Category: Chip SMD Resistors; Stock 1: 180000; Pricing 1: 10000=0.00178, 30000=0.00156, 50000=0.00143, 100000=0.00140 (USD); Case/Package: 0402; Contact Plating: Tin,Matte; Case Code (Imperial): 0402; Case Code (Metric): 1005; Size Code: 0402; Min Operating Temperature: -55°C; Max Operating Temperature: 155°C; Resistance: 620R; Tolerance: 1%; Resistor Type: Thick Film; Packaging: Tape and Reel; Package Quantity: 1; Termination: SMD/SMT; Number of Terminations: 2; Max Power Dissipation: 63mW; Voltage Rating (DC): 50V; Features: Moisture Resistant; Series: RC; Construction: Rectangular; Resistance Tolerance: 1%; Length: 1mm; Width: 0.5mm; Height: 0.016inch; Depth: 0.5mm; REACH SVHC: Unknown; Military Standard: Not; Lead Free: Lead Free; RoHS Compliant: Yes; ComponentLink1URL: https://datasheet.ciiva.com/16867/pyu-rc0402-51-rohs-l-6-16867429.pdf?src-supplier=Avnet+Europe; ComponentLink1Description: https://datasheet.ciiva.com/16867/pyu-rc0402-51-rohs-l-6-16867429.pdf?src-supplier=Avnet+Europe; ComponentLink2URL: https://datasheet.ciiva.com/2453/pyu-r-int-thick-7-2453670.pdf?src-supplier=Digi-Key; ComponentLink2Description: https://datasheet.ciiva.com/2453/pyu-r-int-thick-7-2453670.pdf?src-supplier=Digi-Key; ComponentLink3URL: https://datasheet.ciiva.com/17066/pyu-rc0402-51-rohs-l-6-r-17066550.pdf?src-supplier=Future+Electronics; ComponentLink3Description: https://datasheet.ciiva.com/17066/pyu-rc0402-51-rohs-l-6-r-17066550.pdf?src-supplier=Future+Electronics; ComponentLink4URL: https://datasheet.ciiva.com/2453/pyu-r-int-thick-7-2453672.pdf?src-supplier=Digi-Key; ComponentLink4Description: https://datasheet.ciiva.com/2453/pyu-r-int-thick-7-2453672.pdf?src-supplier=Digi-Key; ComponentLink5URL: https://datasheet.ciiva.com/7850/1018594-7850062.pdf?src-supplier=Element14; ComponentLink5Description: https://datasheet.ciiva.com/7850/1018594-7850062.pdf?src-supplier=Element14; ComponentLink6URL: https://datasheet.ciiva.com/7850/1018594-7850063.pdf?src-supplier=Element14; ComponentLink6Description: https://datasheet.ciiva.com/7850/1018594-7850063.pdf?src-supplier=Element14; ComponentLink7URL: https://datasheet.ciiva.com/8885/pyu-rc0402-51-rohs-l-6-8885125.pdf?src-supplier=Avnet; ComponentLink7Description: https://datasheet.ciiva.com/8885/pyu-rc0402-51-rohs-l-6-8885125.pdf?src-supplier=Avnet; ComponentLink8URL: https://datasheet.ciiva.com/28388/pyu-rc0402-51-rohs-l-6-28388966.pdf?src-supplier=Avnet+Europe; ComponentLink8Description: https://datasheet.ciiva.com/28388/pyu-rc0402-51-rohs-l-6-28388966.pdf?src-supplier=Avnet+Europe; ComponentLink9URL: https://datasheet.ciiva.com/2453/pyu-r-int-thick-7-2453671.pdf?src-supplier=Digi-Key; ComponentLink9Description: https://datasheet.ciiva.com/2453/pyu-r-int-thick-7-2453671.pdf?src-supplier=Digi-Key
R15 R18-R20 = Res: Resistor; Manufacturer 1: Stackpole Electronics; Manufacturer Part Number 1: RMCF1206FT2K00; Supplier 1: Digi-Key; Supplier Part Number 1: RMCF1206FT2K00CT-ND
  R15 R18: VALUE: 2K
  R19: VALUE: 10K
  R20: VALUE: 1.5 K
R16 R17 = Res: Resistor; Manufacturer 1: Panasonic; Manufacturer Part Number 1: ERJ-P06F1001V; VALUE: 1k; ComponentLink1Description: New link; ComponentLink1URL: *; Supplier 1: Digi-Key; Supplier Part Number 1: P16058CT-ND
TP1-TP9 TP14 TP15 TP25 = Test: Test point
U1 = NRF52832-QFAA-R: IC RF TXRX+MCU BLUETOOTH 48QFN; Manufacturer 1: Nordic Semiconductor; Frequency: 2.4GHz; Data Rate: 2Mbps; Sensitivity: -96dBm; Memory Size: 64KB; Number of GPIO: 32; Interface: I2C,SPI,UART; Memory Type: FLASH; Current - Receiving: 10.4mA; Current - Transmitting: 15.2mA; Data Bus Width: 32b; Core Architecture: ARM; Supplier 1: Digi-Key; Manufacturer Part Number 1: NRF52832-QFAA-R; Stock 1: 60000; Pricing 1: 3000=2.59350 (USD); RoHS: Yes; Mount: Surface Mount; Case/Package: QFN; Number of Pins: 48; Min Operating Temperature: -40°C; Max Operating Temperature: 85°C; Packaging: Tape and Reel; RAM Size: 64Kb; Max Frequency: 2.4GHz; Lead Free: Lead Free; ComponentLink1URL: http://www.mouser.com/ds/2/297/nRF52832%20Product%20Brief%20v1.2-890472.pdf?src-supplier=Mouser; ComponentLink1Description: http://www.mouser.com/ds/2/297/nRF52832%20Product%20Brief%20v1.2-890472.pdf?src-supplier=Mouser; ComponentLink2URL: https://www.nordicsemi.com/eng/Products/Bluetooth-Smart-Bluetooth-low-energy/nRF52832?src-supplier=Avnet+Asia; ComponentLink2Description: https://www.nordicsemi.com/eng/Products/Bluetooth-Smart-Bluetooth-low-energy/nRF52832?src-supplier=Avnet+Asia; ComponentLink3URL: http://infocenter.nordicsemi.com/pdf/nRF52832_PB_v1.7.pdf?src-supplier=Digi-Key; ComponentLink3Description: http://infocenter.nordicsemi.com/pdf/nRF52832_PB_v1.7.pdf?src-supplier=Digi-Key; ComponentLink4URL: http://infocenter.nordicsemi.com/pdf/nRF52832_PS_v1.4.pdf?src-supplier=Digi-Key; ComponentLink4Description: http://infocenter.nordicsemi.com/pdf/nRF52832_PS_v1.4.pdf?src-supplier=Digi-Key; Supplier Part Number 1: 1490-1052-2-ND
U2 = Component_1: Linear Voltage Regulator IC Positive Fixed 1 Output 1A TO-252; Manufacturer 1: Rohm Semiconductor; Manufacturer Part Number 1: BA033CC0FP-E2
U3 = LTC4331CUFD#PBF: I2C Slave Device Extender Over Rugged Differential Link 20-QFN; Manufacturer 1: Analog Devices; Supplier 1: Digi-Key; Manufacturer Part Number 1: LTC4331CUFD#PBF; RoHS: Yes; Stock 1: 282; Pricing 1: 1=6.84000, 10=6.17600, 25=5.88880, 100=4.88340, 250=4.45252, 500=4.16528, 1000=3.79400 (USD); RoHS Compliant: Yes; Supplier Part Number 1: LTC4331CUFD#PBF-ND
X1 = FA-12832.0000MF10Z-AJ3: 32MHz ±10ppm Crystal 8pF 60 Ohms 4-SMD, No Lead; Manufacturer 1: Epson; ESR (Equivalent Series Resistance): 60R; Value: 32MHz; Supplier 1: Digi-Key; Manufacturer Part Number 1: FA-12832.0000MF10Z-AJ3; Stock 1: 6250; Pricing 1: 250=0.36000, 500=0.34200, 750=0.31500, 1250=0.28800, 2500=0.27000, 6250=0.26100, 12500=0.25200 (USD); RoHS: Yes; Mount: Surface Mount; Case/Package: SMD/SMT; Min Operating Temperature: -20°C; Max Operating Temperature: 75°C; Packaging: Tape and Reel; Frequency: 32MHz; Load Capacitance: 8pF; Frequency Stability: 10ppm; Frequency Tolerance: 10ppm; Length: 0.079inch; Height: 0.02inch; Width: 0.063inch; Lead Free: Lead Free; ComponentLink1URL: https://www5.epsondevice.com/en/information/support/pdf/june_2018_psc_masterbook.pdf?src-supplier=Digi-Key; ComponentLink1Description: https://www5.epsondevice.com/en/information/support/pdf/june_2018_psc_masterbook.pdf?src-supplier=Digi-Key; ComponentLink2URL: https://support.epson.biz/td/api/doc_check.php?dl=brief_FA-128_en.pdf&src-supplier=Digi-Key; ComponentLink2Description: https://support.epson.biz/td/api/doc_check.php?dl=brief_FA-128_en.pdf&src-supplier=Digi-Key; Supplier Part Number 1: SER4233TR-ND